# Altium schematic sheet DiPHO_Diode_AFE.SchDoc
size A3
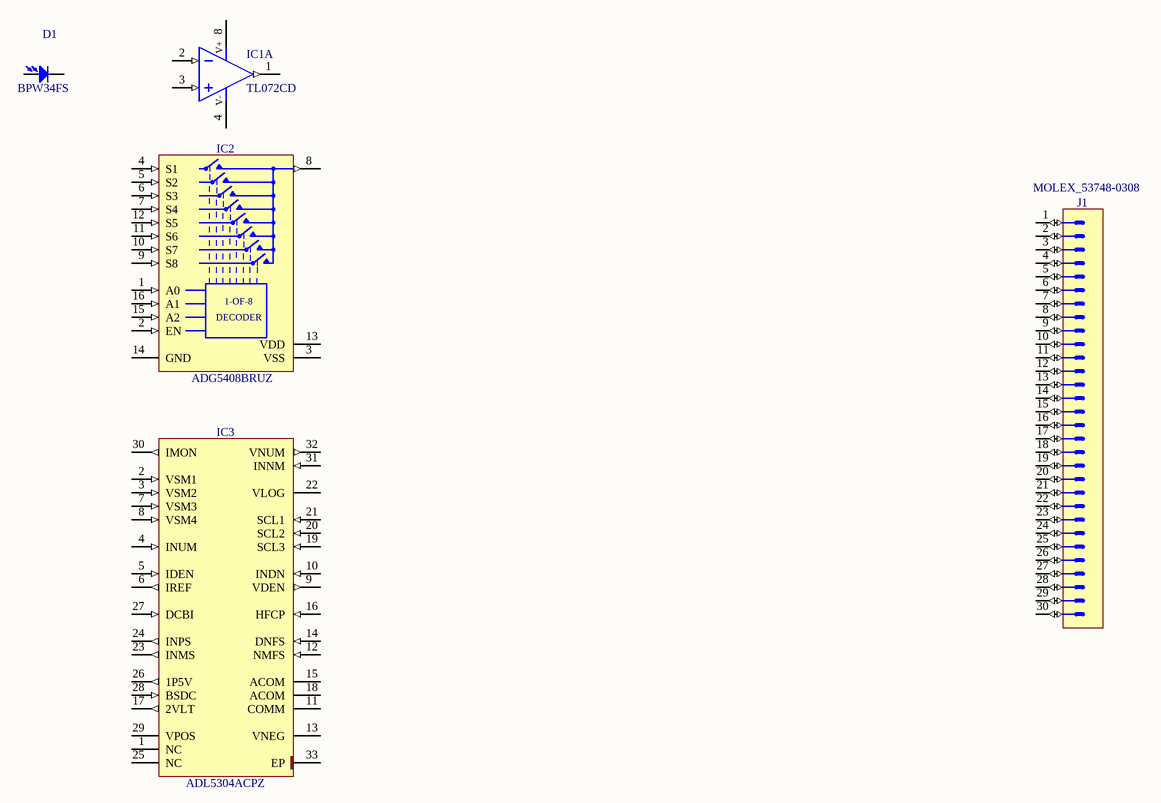
[diagram p0: DiPHO_Diode_AFE.SchDoc]

## Parts
D1  BPW34FS  [OSRAM_BPW34FS]
IC1  TL072CD  [SOIC127P600X175-8N]  (part A of 2)
IC2  ADG5408BRUZ  [SOP65P640X120-16N]
IC3  ADL5304ACPZ  [QFN50P500X500X80-33N-S285]
J1  SlimStack™  [MOLEX_53748-0308]  (value not drawn)

## Nets

Not connected (* = marked no-connect by the designer): D1 1(C) 2(A); IC1 1(OUT) 2(IN-) 3(IN+) 4(V-) 8(V+); IC2 1(A0) 2(EN) 3(VSS) 4(S1) 5(S2) 6(S3) 7(S4) 8(D) 9(S8) 10(S7) 11(S6) 12(S5) 13(VDD) 14(GND) 15(A2) 16(A1); IC3 1(NC) 2(VSM1) 3(VSM2) 4(INUM) 5(IDEN) 6(IREF) 7(VSM3) 8(VSM4) 9(VDEN) 10(INDN) 11(COMM) 12(NMFS) 13(VNEG) 14(DNFS) 15(ACOM) 16(HFCP) 17(2VLT) 18(ACOM) 19(SCL3) 20(SCL2) 21(SCL1) 22(VLOG) 23(INMS) 24(INPS) 25(NC) 26(1P5V) 27(DCBI) 28(BSDC) 29(VPOS) 30(IMON) 31(INNM) 32(VNUM) 33(EP); J1 1 2 3 4 5 6 7 8 9 10 11 12 13 14 15 16 17 18 19 20 21 22 23 24 25 26 27 28 29 30

## Notes on the sheet
- (in symbol ADG5408BRUZ) 1-OF-8; DECODER

## Library data of the parts
D1 = BPW34FS: Photodiode; Part Description: SMT Silicon PIN Photodiode, Photosensitive Area 2.65 x 2.65 mm, with Daylight Filter; Manufacturer: OSRAM; PressFit: No; Bonding: No; Part Number: BPW34FS; Component Kind: Standard; Component Type: Standard; Device: BPW34FS; PackageDescription: SMT Silicon PIN Photodiode, Photosensitive Area 2.65 x 2.65 mm, with Daylight Filter; Manufacturer Part Number: BPW34FS; Pin Count: 2; Mounted: Yes; Socket: No; SMD: Yes; Sense: No; ComponentHeight: 1.2mm; HelpURL: \\cern.ch\dfs\Applications\Altium\Datasheets\BPW34FS.pdf; Author: CERN DEM JLC; CreateDate: 21.09.2011; LatestRevisionDate: 21.09.2011
IC1 = TL072CD: Dual Operational Amplifier; Part Description: Dual Low-Noise JFET-Input Operational Amplifier; Manufacturer: TEXAS INSTRUMENTS; PressFit: No; Bonding: No; Part Number: TL072CD; Component Kind: Standard; Component Type: Standard; Device: TL072CD; PackageDescription: SOIC 8, Pitch 1.27mm - Body 4x5mm, IPC Medium Density; Manufacturer Part Number: TL072CD; Pin Count: 8; Case: SOIC8; Mounted: Yes; Socket: No; SMD: Yes; Sense: No; ComponentHeight: 1.75mm; Author: CERN DEM JMW; HelpURL: \\cern.ch\dfs\Applications\Altium\Datasheets\TL072CD.pdf; CreateDate: 07.05.2008; LatestRevisionDate: 07.05.2008
IC2 = ADG5408BRUZ: High Voltage Latch-Up Proof, 8-Channel Multiplexer; Manufacturer: ANALOG DEVICES; PressFit: No; Bonding: No; Part Number: ADG5408BRUZ; Component Kind: Standard; Component Type: Standard; Device: ADG5408BRUZ; PackageDescription: SOP, 0.65mm Pitch; 16 Pin, 4.40mm W X 5.00mm L X 1.20mm H body, IPC Medium Density; Part Description: High Voltage Latch-Up Proof, 8-Channel Multiplexer; Manufacturer Part Number: ADG5408BRUZ; Pin Count: 16; Case: TSSOP16; Mounted: Yes; Socket: No; SMD: Yes; Sense: No; ComponentHeight: 1.2mm; Author: CERN DEM JLC; HelpURL: \\cern.ch\dfs\Applications\Altium\Datasheets\ADG5408BRUZ.pdf; CreateDate: 18.12.2013; LatestRevisionDate: 18.12.2013
IC3 = ADL5304ACPZ: High Speed, 200 dB Range, Logarithmic Converter; Manufacturer: ANALOG DEVICES; PressFit: No; Bonding: No; Part Number: ADL5304ACPZ; Component Kind: Standard; Component Type: Standard; Device: ADL5304ACPZ; PackageDescription: QFN, 0.50mm Pitch, Square; 32 Pin, 5.00mm L X 5.00mm W X 0.80mm H body (w/Thermal Tab 2.85 X 2.85mm), IPC Medium Density; Part Description: High Speed, 200 dB Range, Logarithmic Converter; Manufacturer Part Number: ADL5304ACPZ; Pin Count: 33; Case: QFN32; Mounted: Yes; Socket: No; SMD: Yes; Sense: No; ComponentHeight: 0.8mm; Author: CERN DEM BC; HelpURL: \\cern.ch\dfs\Applications\Altium\Datasheets\ADL5304ACPZ.pdf; CreateDate: 09.02.2021; LatestRevisionDate: 09.02.2021
J1 = MOLEX_53748-0308: Connector 30 Male; Part Description: 0.50mm Pitch SlimStack™ Dual Row 30 Circuits Surface Mount Vertical Plug (3.00 Stacking Heights); Manufacturer: MOLEX; PressFit: No; Part Number: MOLEX_53748-0308; Component Kind: Standard; Component Type: Standard; Pin Count: 30; Family: SlimStack™; Mounted: Yes; Socket: No; SMD: Yes; Sense: No; Status: None; Manufacturer Part Number: 53748-0308; ComponentHeight: 2.4mm; HelpURL: \\cern.ch\dfs\Applications\Altium\Datasheets\MOLEX_53748-0308.pdf; Author: CERN DEM JLC; CreateDate: 28.08.2012; LatestRevisionDate: 28.08.2012